# Altium schematic sheet OPA847_LNA.SchDoc
size A4; SheetNumber: 3; SheetTotal: 7
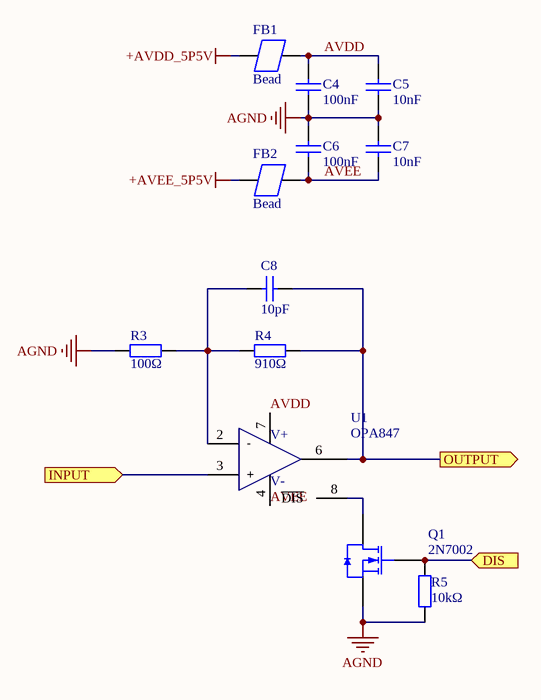
[diagram p0: OPA847_LNA.SchDoc]

## Parts
C4  100nF  [0603_C]
C5  10nF  [0603_C]
C6  100nF  [0603_C]
C7  10nF  [0603_C]
C8  10pF  [0603_C]
FB1  Bead  [0805_L]
FB2  Bead  [0805_L]
Q1  2N7002  [SOT-23(SOT-23-3)]
R3  100Ω  [0603_R]
R4  910Ω  [0603_R]
R5  10kΩ  [0603_R]
U1  OPA847  [SOIC127P600X175-8M]

## Ports
DIS (in), INPUT (in), OUTPUT (out)

## Nets
+AVDD_5P5V: FB1.1
+AVEE_5P5V: FB2.1
AGND: C4.1 C5.1 C6.1 C7.1 Q1.2(S) R3.1 R5.1
AVDD: C4.2 C5.2 FB1.2 U1.7(VCC+)
AVEE: C6.2 C7.2 FB2.2 U1.4(VCC-)
DIS: Q1.1(G) R5.2 ; port DIS
INPUT: U1.3 ; port INPUT
OUTPUT: C8.2 R4.2 U1.6 ; port OUTPUT
NetC8_1: C8.1 R3.2 R4.1 U1.2
NetQ1_3: Q1.3(D) U1.8(~{DIS})

## Notes on the sheet
- (in symbol OPA847) V+; -; +; V-

## Library data of the parts
C4 C6 = 0603 100nF (104) 10% 50V: 贴片电容; ComponentLink1Description: 供应商链接; ComponentLink1URL: http://www.szlcsc.com/product/details_15331.html; Package: 0603; Supplier: LC; SuppliersPartNumber: C14663
C5 C7 = 0603 10nF (103) 10% 50V: 贴片电容; ComponentLink1Description: 供应商链接; ComponentLink1URL: http://www.szlcsc.com/product/details_58143.html; Package: 0603; Supplier: LC; SuppliersPartNumber: C57112
C8 = 0603 10pF (100) 5% 50V: 贴片电容; ComponentLink1Description: 供应商链接; ComponentLink1URL: http://www.szlcsc.com/product/details_1986.html; Package: 0603; Supplier: LC; SuppliersPartNumber: C1634
Q1 = 2N7002 7002: MOS(场效应管); ComponentLink1Description: 供应商链接; ComponentLink1URL: http://www.szlcsc.com/product/details_9040.html; Package: SOT-23(SOT-23-3); Supplier: LC; SuppliersPartNumber: C8545
R3 = 0603 100Ω (1000) 1%: 贴片电阻; ComponentLink1Description: 供应商链接; ComponentLink1URL: http://www.szlcsc.com/product/details_23502.html; Package: 0603; Supplier: LC; SuppliersPartNumber: C22775
R4 = 0603 910Ω (9100) 1%: 贴片电阻; ComponentLink1Description: 供应商链接; ComponentLink1URL: http://www.szlcsc.com/product/details_23991.html; Package: 0603; Supplier: LC; SuppliersPartNumber: C23264
R5 = 0603 10KΩ (1002) 1%: 贴片电阻; ComponentLink1Description: 供应商链接; ComponentLink1URL: http://www.szlcsc.com/product/details_26547.html; Package: 0603; Supplier: LC; SuppliersPartNumber: C25804
U1 = OPA847: Wideband, Ultra-Low Noise, Voltage-Feedback OPERATIONAL AMPLIFIER with Shutdown